# Altium schematic sheet connectors-to-motor-controller.SchDoc
size A4
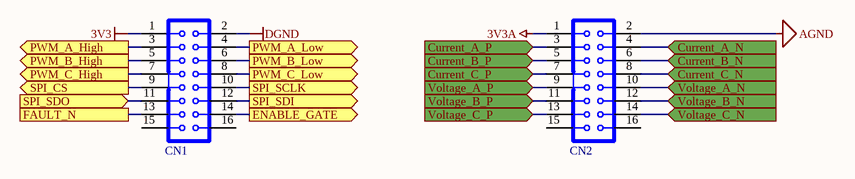
[diagram p0: connectors-to-motor-controller.SchDoc]

## Parts
CN1  BH-16, FC-16  [Szalagkabel 16]  (value not drawn)
CN2  BH-16, FC-16  [Szalagkabel 16]  (value not drawn)

## Ports
Current_A_N (in), Current_A_P (in), Current_B_N (in), Current_B_P (in), Current_C_N (in), Current_C_P (in), ENABLE_GATE (out), FAULT_N, PWM_A_High (out), PWM_A_Low (out), PWM_B_High (out), PWM_B_Low (out), PWM_C_High (out), PWM_C_Low (out), SPI_CS (out), SPI_SCLK (out), SPI_SDI (out), SPI_SDO (in), Voltage_A_N (in), Voltage_A_P (in), Voltage_B_N (in), Voltage_B_P (in), Voltage_C_N (in), Voltage_C_P (in)

## Nets
3V3: CN1.1
3V3A: CN2.1
AGND: CN2.2
DGND: CN1.2
Current_A_N: CN2.4 ; port Current_A_N
Current_A_P: CN2.3 ; port Current_A_P
Current_B_N: CN2.6 ; port Current_B_N
Current_B_P: CN2.5 ; port Current_B_P
Current_C_N: CN2.8 ; port Current_C_N
Current_C_P: CN2.7 ; port Current_C_P
ENABLE_GATE: CN1.14 ; port ENABLE_GATE
FAULT_N: CN1.13 ; port FAULT_N
PWM_A_High: CN1.3 ; port PWM_A_High
PWM_A_Low: CN1.4 ; port PWM_A_Low
PWM_B_High: CN1.5 ; port PWM_B_High
PWM_B_Low: CN1.6 ; port PWM_B_Low
PWM_C_High: CN1.7 ; port PWM_C_High
PWM_C_Low: CN1.8 ; port PWM_C_Low
SPI_CS: CN1.9 ; port SPI_CS
SPI_SCLK: CN1.10 ; port SPI_SCLK
SPI_SDI: CN1.12 ; port SPI_SDI
SPI_SDO: CN1.11 ; port SPI_SDO
Voltage_A_N: CN2.10 ; port Voltage_A_N
Voltage_A_P: CN2.9 ; port Voltage_A_P
Voltage_B_N: CN2.12 ; port Voltage_B_N
Voltage_B_P: CN2.11 ; port Voltage_B_P
Voltage_C_N: CN2.14 ; port Voltage_C_N
Voltage_C_P: CN2.13 ; port Voltage_C_P

Not connected (* = marked no-connect by the designer): CN1 15 16; CN2 15 16

## Library data of the parts
CN1 CN2 = Ribbon cable 16: Part Class: Connector; Order Code: 43-01-70, 43-01-07; Distributor: Lomex; Package: 2.54mm; CompType: BH-16, FC-16